# Altium schematic sheet MW5500.SchDoc
size A4
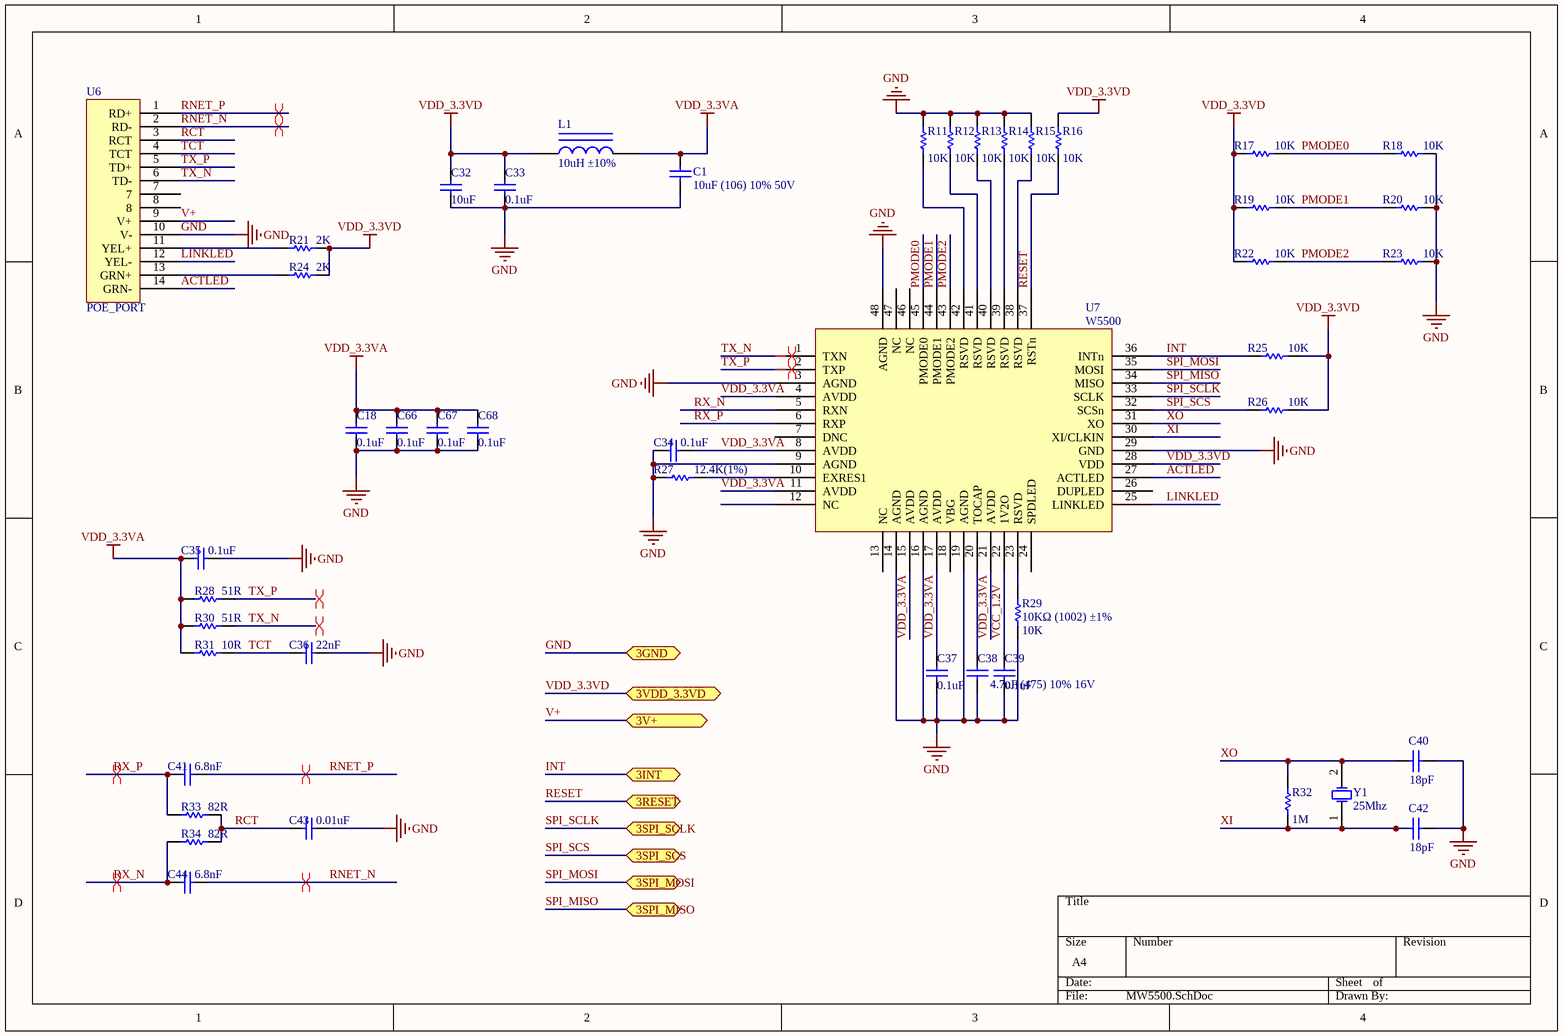
[diagram p0: MW5500.SchDoc]

## Parts
C1  10uF (106) 10% 50V  [1206_C]
C18  value 0.1uF  [1608[0603]]  (hidden comment: 100nF (104) ±10% 50V)
C32  value 10uF  [C1206]  (hidden comment: 10uF (106) ±10% 50V)
C33  value 0.1uF  [1608[0603]]  (hidden comment: 100nF (104) ±10% 50V)
C34  value 0.1uF  [0805_C]  (hidden comment: 100nF (104) ±10% 50V)
C35  value 0.1uF  [1608[0603]]  (hidden comment: 100nF (104) ±10% 50V)
C36  value 22nF  [1608[0603]]  (hidden comment: 22nF ±10% 50V)
C37  value 0.1uF  [1608[0603]]  (hidden comment: 100nF (104) ±10% 50V)
C38  4.7uF (475) 10% 16V  [0603_C]
C39  value 0.1uF  [1608[0603]]  (hidden comment: 100nF (104) ±10% 50V)
C40  value 18pF  [1608[0603]]  (hidden comment: 18pF ±10% 50V)
C41  value 6.8nF  [1608[0603]]  (hidden comment: 6.8nF ±10% 50V)
C42  value 18pF  [1608[0603]]  (hidden comment: 18pF ±10% 50V)
C43  value 0.01uF  [1608[0603]]  (hidden comment: 100nF (104) ±10% 50V)
C44  value 6.8nF  [1608[0603]]  (hidden comment: 6.8nF ±10% 50V)
C66  value 0.1uF  [1608[0603]]  (hidden comment: 100nF (104) ±10% 50V)
C67  value 0.1uF  [1608[0603]]  (hidden comment: 100nF (104) ±10% 50V)
C68  value 0.1uF  [1608[0603]]  (hidden comment: 100nF (104) ±10% 50V)
L1  10uH ±10%  [1206_L]
R11  value 10K  [1608[0603]]  (hidden comment: 10KΩ (1002) ±1%)
R12  value 10K  [1608[0603]]  (hidden comment: 10KΩ (1002) ±1%)
R13  value 10K  [1608[0603]]  (hidden comment: 10KΩ (1002) ±1%)
R14  value 10K  [1608[0603]]  (hidden comment: 10KΩ (1002) ±1%)
R15  value 10K  [1608[0603]]  (hidden comment: 10KΩ (1002) ±1%)
R16  value 10K  [1608[0603]]  (hidden comment: 10KΩ (1002) ±1%)
R17  value 10K  [1608[0603]]  (hidden comment: 10KΩ (1002) ±1%)
R18  value 10K  [1608[0603]]  (hidden comment: 10KΩ (1002) ±1%)
R19  value 10K  [1608[0603]]  (hidden comment: 10KΩ (1002) ±1%)
R20  value 10K  [1608[0603]]  (hidden comment: 10KΩ (1002) ±1%)
R21  value 2K  [1608[0603]]  (hidden comment: 2KΩ (1001) ±1%)
R22  value 10K  [1608[0603]]  (hidden comment: 10KΩ (1002) ±1%)
R23  value 10K  [1608[0603]]  (hidden comment: 10KΩ (1002) ±1%)
R24  value 2K  [1608[0603]]  (hidden comment: 2KΩ (1001) ±1%)
R25  value 10K  [1608[0603]]  (hidden comment: 10KΩ (1002) ±1%)
R26  value 10K  [1608[0603]]  (hidden comment: 10KΩ (1002) ±1%)
R27  value 12.4K(1%)  [1608[0603]]  (hidden comment: 12.4KΩ   ±1%)
R28  value 51R  [1608[0603]]  (hidden comment: 51Ω (51R0) ±1%)
R29  10KΩ (1002) ±1%  value 10K  [1608[0603]]
R30  value 51R  [1608[0603]]  (hidden comment: 51Ω (51R0) ±1%)
R31  value 10R  [1608[0603]]  (hidden comment: 10Ω (10R0) ±1%)
R32  value 1M  [1608[0603]]  (hidden comment: 1MΩ (1004) ±1%)
R33  value 82R  [1608[0603]]  (hidden comment: 82Ω (82R0) ±1%)
R34  value 82R  [1608[0603]]  (hidden comment: 82Ω (82R0) ±1%)
U6  POE_PORT  [POE_RJ45]
U7  W5500  [LQFP48]
Y1  25Mhz  [XTAL]

## Ports
3GND, 3INT, 3RESET, 3SPI_MISO, 3SPI_MOSI, 3SPI_SCLK, 3SPI_SCS, 3V+, 3VDD_3.3VD

## Nets
GND: C1.1 C18.1 C32.1 C33.1 C34.1 C35.2 C36.2 C37.1 C38.1 C39.1 C40.1 C42.1 C43.2 C66.1 C67.1 C68.1 R11.2 R12.2 R13.2 R14.2 R15.2 R18.2 R20.2 R23.2 R27.1 R29.1 U6.10(V-) U7.3(AGND) U7.9(AGND) U7.14(AGND) U7.16(AGND) U7.19(AGND) U7.29(GND) U7.48(AGND) ; port 3GND
VDD_3.3VA: C1.2 C18.2 C34.2 C35.1 C37.2 C66.2 C67.2 C68.2 L1.2 R28.1 R30.1 R31.1 U7.4(AVDD) U7.8(AVDD) U7.11(AVDD) U7.15(AVDD) U7.17(AVDD) U7.21(AVDD)
VDD_3.3VD: C32.2 C33.2 L1.1 R16.2 R17.1 R19.1 R21.2 R22.1 R24.2 R25.2 R26.2 U7.28(VDD) ; port 3VDD_3.3VD
ACTLED: U6.14(GRN-) U7.27(ACTLED)
INT: R25.1 U7.36(INTn) ; port 3INT
LINKLED: U6.12(YEL-) U7.25(LINKLED)
PMODE0: R17.2 R18.1 U7.45(PMODE0)
PMODE1: R19.2 R20.1 U7.44(PMODE1)
PMODE2: R22.2 R23.1 U7.43(PMODE2)
RCT: C43.1 R33.2 R34.2 U6.3(RCT)
RESET: R16.1 U7.37(RSTn) ; port 3RESET
RNET_N: C44.2 U6.2(RD-)
RNET_P: C41.2 U6.1(RD+)
RX_N: C44.1 R34.1 U7.5(RXN)
RX_P: C41.1 R33.1 U7.6(RXP)
SPI_MISO: U7.34(MISO) ; port 3SPI_MISO
SPI_MOSI: U7.35(MOSI) ; port 3SPI_MOSI
SPI_SCLK: U7.33(SCLK) ; port 3SPI_SCLK
SPI_SCS: R26.1 U7.32(SCSn) ; port 3SPI_SCS
TCT: C36.1 R31.2 U6.4(TCT)
TX_N: R30.2 U6.6(TD-) U7.1(TXN)
TX_P: R28.2 U6.5(TD+) U7.2(TXP)
V+: U6.9(V+) ; port 3V+
VCC_1.2V: C39.2 U7.22(1V2O)
XI: C42.2 R32.1 U7.30(XI/CLKIN) Y1.1(OSC1)
XO: C40.2 R32.2 U7.31(XO) Y1.2(OSC2)
NetC38_2: C38.2 U7.20(TOCAP)
NetR11_1: R11.1 U7.42(RSVD)
NetR12_1: R12.1 U7.41(RSVD)
NetR13_1: R13.1 U7.40(RSVD)
NetR14_1: R14.1 U7.39(RSVD)
NetR15_1: R15.1 U7.38(RSVD)
NetR21_1: R21.1 U6.11(YEL+)
NetR24_1: R24.1 U6.13(GRN+)
NetR27_2: R27.2 U7.10(EXRES1)
NetR29_2: R29.2 U7.23(RSVD)

Not connected (* = marked no-connect by the designer): U6 7 8; U7 7(DNC) 12(NC) 13(NC) 18(VBG) 24(SPDLED) 26(DUPLED) 46(NC) 47(NC)

## Layout directives
differential pair: RNET_N, RNET_P, RX_N, RX_P, TX_N, TX_P

## Library data of the parts
C1 = 1206 10uF (106) 10% 50V: 贴片电容; ComponentLink1Description: 供应商链接; ComponentLink1URL: http://www.szlcsc.com/product/details_14236.html; Package: 1206; Supplier: LC; SuppliersPartNumber: C13585
C18 C32-C37 C39-C44 C66-C68 = Cap: Capacitor; Published: 8-Jun-2000; LatestRevisionDate: 17-Jul-2002; LatestRevisionNote: Re-released for DXP Platform.; PackageReference: RAD-0.3; Publisher: Altium Limited; PackageDescription: Radial Cap, Thru-Hole; 2 Leads; 0.3 in Pin Spacing
C38 = 0603 4.7uF (475) 10% 16V: 贴片电容; ComponentLink1Description: 供应商链接; ComponentLink1URL: http://www.szlcsc.com/product/details_20375.html; Package: 0603; Supplier: LC; SuppliersPartNumber: C19666
L1 = 1206 10uH 10%: 贴片电感; ComponentLink1Description: 供应商链接; ComponentLink1URL: http://www.szlcsc.com/product/details_1403.html; Package: 1206; Supplier: LC; SuppliersPartNumber: C1051
R11-R34 = Res1: Resistor; Published: 8-Jun-2000; LatestRevisionDate: 17-Jul-2002; LatestRevisionNote: Re-released for DXP Platform.; PackageReference: AXIAL-0.3; Publisher: Altium Limited; PackageDescription: Axial Device, Thru-Hole; 2 Leads; 0.3 in Pin Spacing
Y1 = XTAL: Crystal Oscillator; Published: 8-Jun-2000; LatestRevisionDate: 17-Jul-2002; LatestRevisionNote: Re-released for DXP Platform.; PackageReference: R38; Publisher: Altium Limited; PackageDescription: Crystal, Thru-Hole; 2 Leads; Body 3.1 x 8.2 mm (Dia.xH)